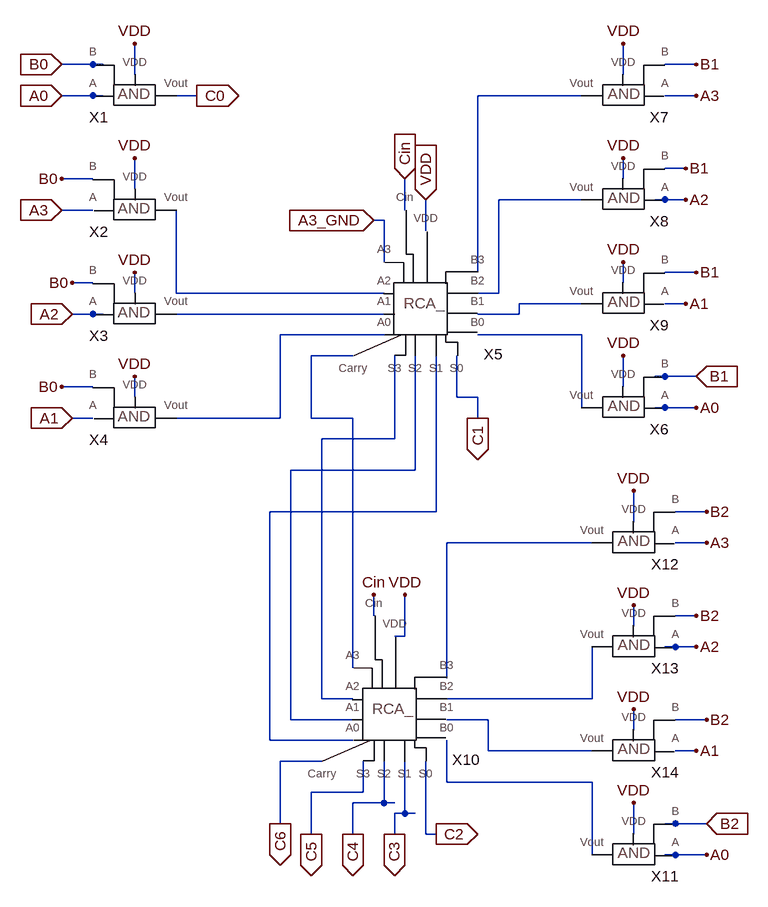
[diagram p0: schematic Mult_4_3.asc]
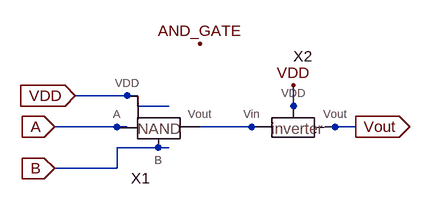
[diagram p1: sub-circuit and_gate.asc]
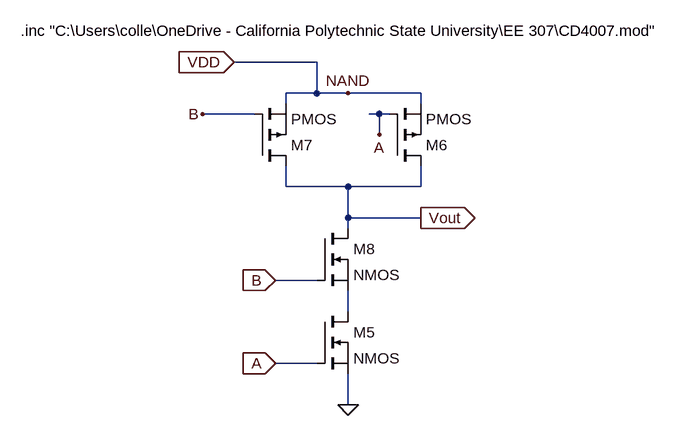
[diagram p2: sub-circuit nand_gate.asc]
Mult_4_3.asc, the LTspice schematic file:
Version 4
SHEET 1 1148 1356
WIRE -128 80 -176 80
WIRE -112 80 -128 80
WIRE 800 80 752 80
WIRE -64 96 -64 48
WIRE 688 96 688 48
WIRE -128 128 -176 128
WIRE -112 128 -128 128
WIRE 32 128 0 128
WIRE 624 128 464 128
WIRE 800 128 752 128
WIRE 784 240 752 240
WIRE -128 256 -176 256
WIRE 688 256 688 224
WIRE -64 272 -64 224
WIRE 624 288 496 288
WIRE 752 288 736 288
WIRE 784 288 752 288
WIRE -128 304 -176 304
WIRE 352 304 352 256
WIRE 320 320 304 320
WIRE 384 336 384 288
WIRE 320 384 320 320
WIRE 464 400 464 128
WIRE 800 400 752 400
WIRE -128 416 -160 416
WIRE 688 416 688 384
WIRE -64 432 -64 400
WIRE 0 432 0 304
WIRE 320 432 0 432
WIRE 496 432 496 288
WIRE 496 432 464 432
WIRE 624 448 528 448
WIRE 784 448 752 448
WIRE -128 464 -160 464
WIRE -112 464 -128 464
WIRE 320 464 0 464
WIRE 528 464 528 448
WIRE 528 464 464 464
WIRE 320 496 160 496
WIRE 624 496 464 496
WIRE 272 528 208 528
WIRE 752 560 736 560
WIRE 800 560 752 560
WIRE -128 576 -176 576
WIRE 688 576 688 528
WIRE -64 592 -64 560
WIRE 432 592 432 528
WIRE 464 592 432 592
WIRE 624 608 624 496
WIRE 752 608 736 608
WIRE 800 608 752 608
WIRE -128 624 -160 624
WIRE 160 624 160 496
WIRE 160 624 0 624
WIRE 208 624 208 528
WIRE 272 624 208 624
WIRE 464 624 464 592
WIRE 336 656 336 528
WIRE 336 656 224 656
WIRE 368 704 368 528
WIRE 368 704 176 704
WIRE 400 768 400 528
WIRE 400 768 144 768
WIRE 816 768 768 768
WIRE 704 784 704 736
WIRE 640 816 416 816
WIRE 816 816 768 816
WIRE 304 928 304 896
WIRE 800 928 768 928
WIRE 704 944 704 912
WIRE 352 960 352 896
WIRE 352 960 336 960
WIRE 768 976 752 976
WIRE 800 976 768 976
WIRE 272 1008 272 624
WIRE 416 1024 416 816
WIRE 224 1056 224 656
WIRE 272 1056 224 1056
WIRE 640 1056 640 976
WIRE 640 1056 416 1056
WIRE 176 1088 176 704
WIRE 272 1088 176 1088
WIRE 480 1088 416 1088
WIRE 816 1088 768 1088
WIRE 704 1104 704 1072
WIRE 144 1120 144 768
WIRE 272 1120 144 1120
WIRE 480 1136 480 1088
WIRE 640 1136 480 1136
WIRE 800 1136 768 1136
WIRE 224 1152 160 1152
WIRE 416 1184 416 1120
WIRE 640 1184 416 1184
WIRE 288 1200 288 1152
WIRE 288 1200 208 1200
WIRE 320 1216 320 1152
WIRE 320 1216 272 1216
WIRE 336 1216 320 1216
WIRE 352 1232 352 1152
WIRE 352 1232 336 1232
WIRE 368 1232 352 1232
WIRE 160 1248 160 1152
WIRE 768 1248 752 1248
WIRE 816 1248 768 1248
WIRE 208 1264 208 1200
WIRE 272 1264 272 1216
WIRE 336 1264 336 1232
WIRE 384 1264 384 1152
WIRE 400 1264 384 1264
WIRE 704 1264 704 1216
WIRE 640 1296 640 1184
WIRE 768 1296 752 1296
WIRE 816 1296 768 1296
FLAG -176 80 B0
IOPIN -176 80 In
FLAG -176 256 B0
FLAG -160 416 B0
FLAG -176 576 B0
FLAG -176 128 A0
IOPIN -176 128 In
FLAG -176 304 A3
IOPIN -176 304 In
FLAG -160 464 A2
IOPIN -160 464 In
FLAG -160 624 A1
IOPIN -160 624 In
FLAG -64 224 VDD
FLAG -64 48 VDD
FLAG -64 400 VDD
FLAG -64 560 VDD
FLAG 384 288 VDD
IOPIN 384 288 In
FLAG 352 256 Cin
IOPIN 352 256 In
FLAG 304 320 A3_GND
IOPIN 304 320 In
FLAG 32 128 C0
IOPIN 32 128 Out
FLAG 464 624 C1
IOPIN 464 624 Out
FLAG 400 1264 C2
IOPIN 400 1264 Out
FLAG 336 1264 C3
IOPIN 336 1264 Out
FLAG 272 1264 C4
IOPIN 272 1264 Out
FLAG 208 1264 C5
IOPIN 208 1264 Out
FLAG 800 560 B1
IOPIN 800 560 In
FLAG 800 80 B1
FLAG 784 240 B1
FLAG 800 400 B1
FLAG 800 608 A0
FLAG 800 128 A3
FLAG 784 288 A2
FLAG 784 448 A1
FLAG 688 48 VDD
FLAG 688 528 VDD
FLAG 688 224 VDD
FLAG 688 384 VDD
FLAG 816 1248 B2
IOPIN 816 1248 In
FLAG 816 768 B2
FLAG 800 928 B2
FLAG 816 1088 B2
FLAG 816 1296 A0
FLAG 816 816 A3
FLAG 800 976 A2
FLAG 800 1136 A1
FLAG 704 736 VDD
FLAG 704 1216 VDD
FLAG 704 912 VDD
FLAG 704 1072 VDD
FLAG 160 1248 C6
IOPIN 160 1248 Out
FLAG 304 896 Cin
FLAG 352 896 VDD
SYMBOL AND_gate -32 128 R0
SYMATTR InstName X1
SYMBOL AND_gate -32 304 R0
SYMATTR InstName X2
SYMBOL AND_gate -32 464 R0
SYMATTR InstName X3
SYMBOL AND_gate -32 624 R0
SYMATTR InstName X4
SYMBOL RCA_ 368 496 R0
SYMATTR InstName X5
SYMBOL AND_gate 656 608 M0
SYMATTR InstName X6
SYMBOL AND_gate 656 128 M0
SYMATTR InstName X7
SYMBOL AND_gate 656 288 M0
SYMATTR InstName X8
SYMBOL AND_gate 656 448 M0
SYMATTR InstName X9
SYMBOL RCA_ 320 1120 R0
SYMATTR InstName X10
SYMBOL AND_gate 672 1296 M0
SYMATTR InstName X11
SYMBOL AND_gate 672 816 M0
SYMATTR InstName X12
SYMBOL AND_gate 672 976 M0
SYMATTR InstName X13
SYMBOL AND_gate 672 1136 M0
SYMATTR InstName X14

and_gate.asc, the sub-circuit schematic file:
Version 4
SHEET 1 880 680
WIRE 80 128 -16 128
WIRE 80 144 80 128
WIRE 128 144 80 144
WIRE 320 144 320 112
WIRE 320 160 320 144
WIRE 64 176 -48 176
WIRE 192 176 176 176
WIRE 256 176 192 176
WIRE 272 176 256 176
WIRE 384 176 368 176
WIRE 416 176 384 176
WIRE 128 208 48 208
WIRE 48 240 48 208
WIRE 48 240 -48 240
FLAG -16 128 VDD
IOPIN -16 128 In
FLAG -48 176 A
IOPIN -48 176 In
FLAG -48 240 B
IOPIN -48 240 In
FLAG 416 176 Vout
IOPIN 416 176 Out
FLAG 320 112 VDD
FLAG 176 48 AND_GATE
SYMBOL Nand_gate 160 192 R0
SYMATTR InstName X1
SYMBOL Inverter 352 192 R0
SYMATTR InstName X2

nand_gate.asc, the sub-circuit schematic file:
Version 4
SHEET 1 880 680
WIRE -224 -192 -352 -192
WIRE -224 -144 -224 -192
WIRE -224 -144 -272 -144
WIRE -176 -144 -224 -144
WIRE -64 -144 -176 -144
WIRE -272 -128 -272 -144
WIRE -64 -128 -64 -144
WIRE -320 -112 -400 -112
WIRE -128 -112 -144 -112
WIRE -112 -112 -128 -112
WIRE -128 -80 -128 -112
WIRE -272 0 -272 -32
WIRE -176 0 -272 0
WIRE -64 0 -64 -32
WIRE -64 0 -176 0
WIRE -176 48 -176 0
WIRE -64 48 -176 48
WIRE -176 64 -176 48
WIRE -224 144 -288 144
WIRE -176 192 -176 160
WIRE -224 272 -288 272
WIRE -176 336 -176 288
FLAG -176 -144 NAND
FLAG -176 336 0
FLAG -288 272 A
IOPIN -288 272 In
FLAG -128 -80 A
FLAG -400 -112 B
FLAG -288 144 B
IOPIN -288 144 In
FLAG -64 48 Vout
IOPIN -64 48 Out
FLAG -352 -192 VDD
IOPIN -352 -192 In
SYMBOL nmos -224 192 R0
SYMATTR InstName M5
SYMBOL pmos -112 -32 M180
SYMATTR InstName M6
SYMBOL pmos -320 -32 M180
SYMATTR InstName M7
SYMBOL nmos -224 64 R0
SYMATTR InstName M8
TEXT -680 -240 Left 2 !.inc "C:\\Users\\colle\\OneDrive - California Polytechnic State University\\EE 307\\CD4007.mod"

The netlist it stands for:
* Mult_4_3.asc
XX1 A0 VDD C0 B0 and_gate
XX2 A3 VDD N003 B0 and_gate
XX3 A2 VDD N005 B0 and_gate
XX4 A1 VDD N006 B0 and_gate
XX5 A3_GND N003 N005 N006 N009 N010 N011 C1 N008 N001 N002 VDD N004 N007 Cin RCA_  ; pins A3 A2 A1 A0 S3 S2 S1 S0 Carry B3 B2 VDD B1 B0 Cin
XX6 A0 VDD N007 B1 and_gate
XX7 A3 VDD N001 B1 and_gate
XX8 A2 VDD N002 B1 and_gate
XX9 A1 VDD N004 B1 and_gate
XX10 N008 N009 N010 N011 C5 C4 C3 C2 C6 N012 N013 VDD N014 N015 Cin RCA_  ; pins A3 A2 A1 A0 S3 S2 S1 S0 Carry B3 B2 VDD B1 B0 Cin
XX11 A0 VDD N015 B2 and_gate
XX12 A3 VDD N012 B2 and_gate
XX13 A2 VDD N013 B2 and_gate
XX14 A1 VDD N014 B2 and_gate

* block symbol definitions
.subckt and_gate A VDD Vout B
XX1 A B N001 VDD nand_gate
XX2 N001 VDD Vout Inverter  ; pins Vin VDD Vout
.ends and_gate

.subckt nand_gate A B Vout VDD
M5 N001 A 0 0 NMOS
M6 Vout A VDD VDD PMOS
M7 Vout B VDD VDD PMOS
M8 Vout B N001 N001 NMOS
.inc "C:\Users\colle\OneDrive - California Polytechnic State University\EE 307\CD4007.mod"
.ends nand_gate

.model NMOS NMOS
.model PMOS PMOS
.lib standard.mos
.backanno
.end